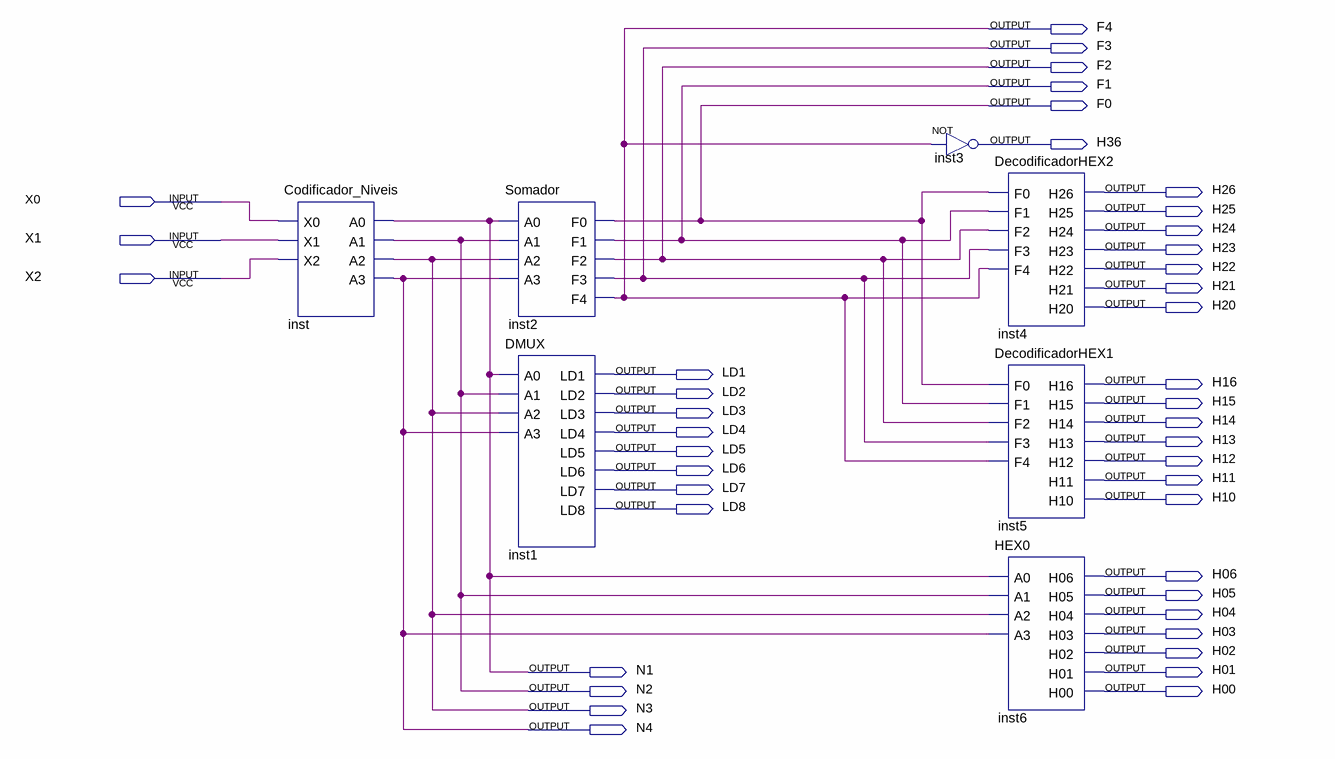
[diagram p0: schematic sheet]
// Quartus schematic Sistema_Simulacao.bdf as structural Verilog: 7 symbols, 42 pins
module Sistema_Simulacao (
  input  X0,
  input  X1,
  input  X2,
  output F4,
  output F3,
  output F2,
  output F1,
  output F0,
  output H36,
  output H26,
  output H25,
  output H24,
  output H23,
  output H22,
  output H21,
  output H20,
  output LD1,
  output H16,
  output LD2,
  output H15,
  output LD3,
  output H14,
  output LD4,
  output H13,
  output LD5,
  output H12,
  output LD6,
  output H11,
  output LD7,
  output H10,
  output LD8,
  output H06,
  output H05,
  output H04,
  output H03,
  output H02,
  output N1,
  output H01,
  output N2,
  output H00,
  output N3,
  output N4
);

  Codificador_Niveis inst (.X0(X0), .X1(X1), .X2(X2), .A0(N1), .A1(N2), .A2(N3), .A3(N4));
  Somador inst2 (.A0(N1), .A1(N2), .A2(N3), .A3(N4), .F0(F0), .F1(F1), .F2(F2), .F3(F3), .F4(F4));
  DMUX inst1 (
    .A0(N1), .A1(N2), .A2(N3), .A3(N4), .LD1(LD1), .LD2(LD2), .LD3(LD3), .LD4(LD4), .LD5(LD5), .LD6(LD6),
    .LD7(LD7), .LD8(LD8));
  not inst3 (H36, F4);
  DecodificadorHEX2 inst4 (
    .F0(F0), .F1(F1), .F2(F2), .F3(F3), .F4(F4), .H26(H26), .H25(H25), .H24(H24), .H23(H23), .H22(H22),
    .H21(H21), .H20(H20));
  DecodificadorHEX1 inst5 (
    .F0(F0), .F1(F1), .F2(F2), .F3(F3), .F4(F4), .H16(H16), .H15(H15), .H14(H14), .H13(H13), .H12(H12),
    .H11(H11), .H10(H10));
  HEX0 inst6 (
    .A0(N1), .A1(N2), .A2(N3), .A3(N4), .H06(H06), .H05(H05), .H04(H04), .H03(H03), .H02(H02), .H01(H01),
    .H00(H00));
endmodule
